# EAGLE design piezo-preamp-tickler_V3-7_single-supply-TL072 (EAGLE 8.7.0)

## Sheet 1 of 2
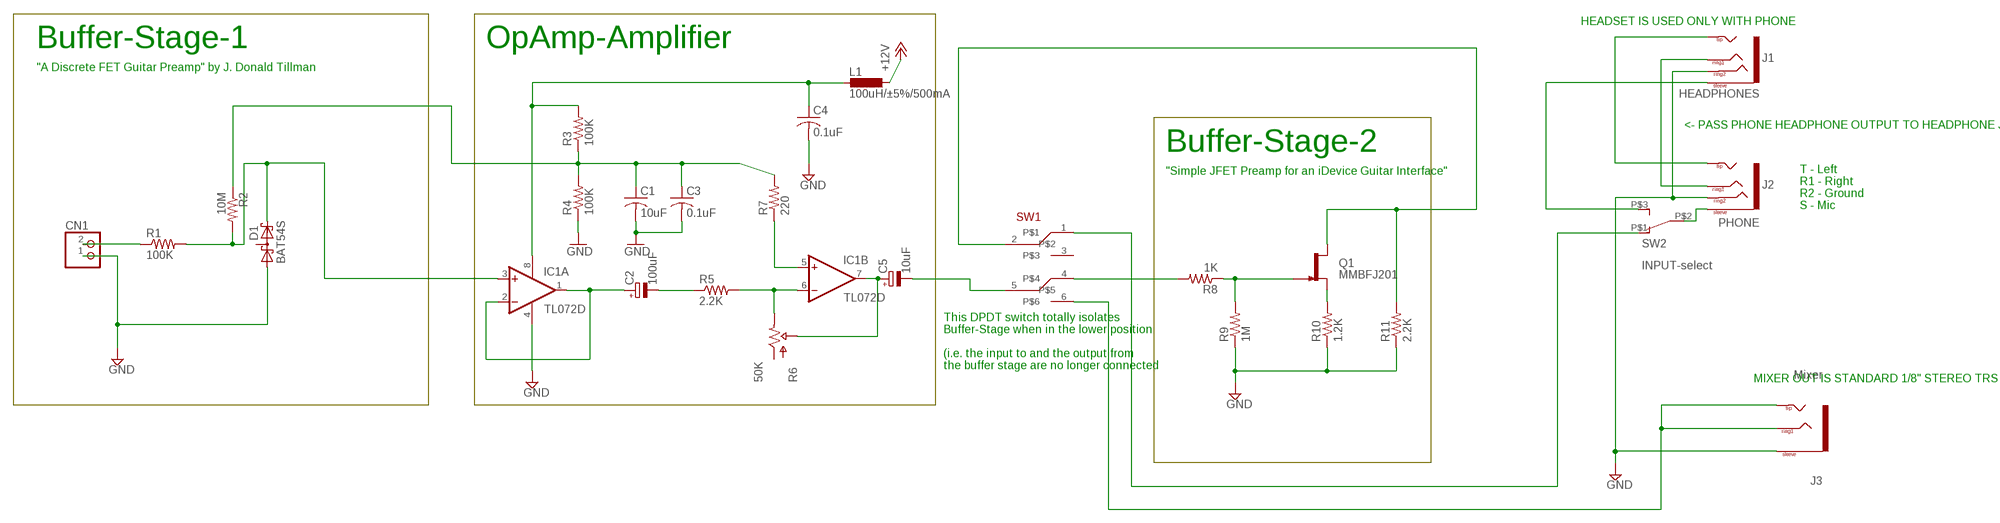
[diagram p0: schematic, sheet 1]

### Parts
C1  10uF  C-USC0805K  [C0805K]
C2  100uF  CPOL-EUC  [PANASONIC_C]
C3  0.1uF  C-USC0805K  [C0805K]
C4  0.1uF  C-USC0805K  [C0805K]
C5  10uF  CPOL-EUB  [PANASONIC_B]
CN1  JST_2PIN-THM  [JST-PH-2-THM]
D1  BAT54S  [SOT23]
IC1  TL072D  [SO08]
J1  HEADPHONES  TRRS-1/8"-3.5MMLGPADS  [TRRS_SJ-43514-SMT-TR]
J2  PHONE  TRRS-1/8"-3.5MMLGPADS  [TRRS_SJ-43514-SMT-TR]
J3  Mixer  TRS-1/8"-3.5MM  [TRS_SJ-3524-SMT]
L1  100uH/±5%/500mA  L-EUL3225M  [L3225M]
Q1  MMBFJ201  J201SOT-23  [SOT23-3]
R1  100K  R-US_R0603  [R0603]
R2  10M  R-US_R0603  [R0603]
R3  100K  R-US_R0603  [R0603]
R4  100K  R-US_R0603  [R0603]
R5  2.2K  R-US_R0603  [R0603]
R6  50K  POTTHUMBPOT14  [THUMBPOT14MM]
R7  220  R-US_R0603  [R0603]
R8  1K  R-US_R0603  [R0603]
R9  1M  R-US_R0603  [R0603]
R10  1.2K  R-US_R0603  [R0603]
R11  2.2K  R-US_R0603  [R0603]
SW1  SWITCH_DPDT  [SWITCH_DPDT_CL-SB-22B]
SW2  INPUT-select  SWITCH_SPDTCL-SB-12B  [SWITCH_SPDT_CL-SB-12B]

### Nets
+12V: L1.1 ; also sheet 2
GND: C1.2 C3.2 C4.2 CN1.1 D1.1(A1) IC1.4(P:V-) J1.RING2 J2.RING2 J3.1(SLEEVE) R4.1 R9.1 R10.1 R11.1 ; also sheet 2
N$1: D1.2(C2) IC1.3(A:+IN) R1.2 R2.2
N$2: CN1.2 R1.1
N$3: Q1.2(S) R10.2
N$4: J1.EARTH(SLEEVE) SW2.P$3
N$5: IC1.5(B:+IN) R7.1
N$6: C5.+ IC1.7(B:OUT) R6.P$2(WIPER)
N$7: IC1.6(B:-IN) R5.2 R6.P$3(OUT)
N$8: C4.1 IC1.8(P:V+) L1.2 R3.2
N$9: C1.1 C3.1 R2.1 R3.1 R4.2 R7.2
N$10: Q1.3(G) R8.1 R9.2
N$11: R8.2 SW1.4
N$12: J3.2(TIP) J3.3(RING1) J3.4(TIP) SW1.6
N$13: J1.RING1 J2.RING1
N$14: C2.- R5.1
N$16: C5.- SW1.5
N$17: J2.EARTH(SLEEVE) SW2.P$2
N$19: SW1.1 SW2.P$1
N$24: C2.+ IC1.1(A:OUT) IC1.2(A:-IN)
N$33: J1.TIP J2.TIP
SELECT: Q1.1(D) R11.2 SW1.2
Unconnected: D1.3(C1A2) R6.P$1(IN) SW1.3

### Notes on the sheet
- HEADSET IS USED ONLY WITH PHONE
- Buffer-Stage-1 | OpAmp-Amplifier
- "A Discrete FET Guitar Preamp" by J. Donald Tillman
- <- PASS PHONE HEADPHONE OUTPUT TO HEADPHONE JACK
- Buffer-Stage-2
- "Simple JFET Preamp for an iDevice Guitar Interface"
- T - Left
  R1 - Right
  R2 - Ground
  S - Mic
- This DPDT switch totally isolates 
  Buffer-Stage when in the lower position
  
  (i.e. the input to and the output from 
  the buffer stage are no longer connected
- MIXER OUT IS STANDARD 1/8" STEREO TRS

## Sheet 2 of 2
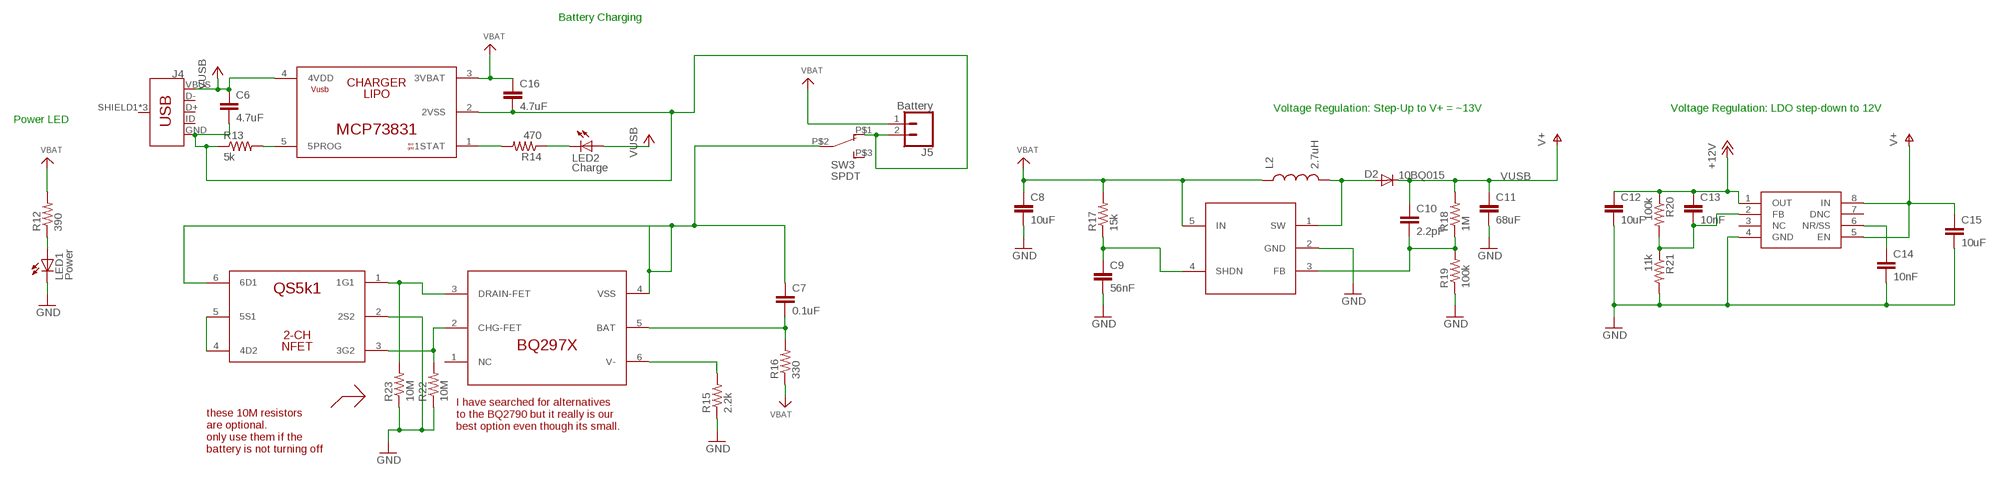
[diagram p1: schematic, sheet 2]

### Parts
C6  4.7uF  C-EUC0603  [C0603]
C7  0.1uF  C-EUC0603  [C0603]
C8  10uF  C-EUC0603  [C0603]
C9  56nF  C-EUC0603  [C0603]
C10  2.2pF  C-EUC0603  [C0603]
C11  68uF  C-EUC1206  [C1206]
C12  10uF  C-EUC0603  [C0603]
C13  10nF  C-EUC0603  [C0603]
C14  10nF  C-EUC0603  [C0603]
C15  10uF  C-EUC0603  [C0603]
C16  4.7uF  C-EUC0603  [C0603]
D2  10BQ015  DIODESMA  [SMA-DIODE]
IC2  MCP73831  [SOT-23-5]
IC3  QS6K1  [SOT457R_PHILIPS]
IC4  BQ297X  BQ297X-BATTERY-MANAGERLONG  [WSON-6-LONG]
IC5  SC4503  [SOT23-5]
IC6  TPS7A49  [MSOP-8]
J4  USB_MICRO-BREDUCED_PASTE  [USB-B-MICRO-SMD_RED_PASTE]
J5  Battery  CONN_02LOCK  [1X02_LOCK]
L2  2.7uH  INDUCTORCR54  [CR54]
LED1  Power  LED3MM  [LED3MM]
LED2  Charge  LED3MM  [LED3MM]
R12  390  R-US_R0603  [R0603]
R13  5k  R-US_R0603  [R0603]
R14  470  R-US_R0603  [R0603]
R15  2.2k  R-US_R0603  [R0603]
R16  330  R-US_R0603  [R0603]
R17  15k  R-US_R0603  [R0603]
R18  1M  R-US_R0603  [R0603]
R19  100k  R-US_R0603  [R0603]
R20  100k  R-US_R0603  [R0603]
R21  11k  R-US_R0603  [R0603]
R22  10M  R-US_R0603  [R0603]
R23  10M  R-US_R0603  [R0603]
SW3  SPDT  SWITCH_SPDTCL-SB-12B  [SWITCH_SPDT_CL-SB-12B]

### Nets
+5V: C6.1 IC2.4(4VDD) J4.VBUS LED2.A ; supply symbol labelled VUSB
+12V: C12.1 C13.1 IC6.1(OUT) R20.1 ; also sheet 1
BATGND: C7.1 IC3.6(6D1) IC4.4(VSS) SW3.P$2
GND: C8.2 C9.2 C11.2 C12.2 C14.2 C15.2 IC3.2(2S2) IC5.2(GND) IC6.4(GND) LED1.K(C) R15.1 R19.1 R21.2 R22.1 R23.1 ; also sheet 1
N$18: LED1.A R12.1
N$21: IC2.5(5PROG) R13.2
N$22: LED2.K(C) R14.1
N$23: IC3.4(4D2) IC3.5(5S1)
N$25: IC2.1(1STAT) R14.2
N$26: C13.2 IC6.2(FB) R20.2 R21.1
N$27: IC3.1(1G1) IC4.3(DRAIN-FET) R23.2
N$28: C14.1 IC6.6(NR/SS)
N$29: C9.1 IC5.4(SHDN) R17.1
N$30: C10.2 IC5.3(FB) R18.1 R19.2
N$31: IC3.3(3G2) IC4.2(CHG-FET) R22.2
N$32: D2.A IC5.1(SW) L2.P$2
N$34: IC4.6(V-) R15.2
N$42: C7.2 IC4.5(BAT) R16.2
USBGND: C6.2 C16.2 IC2.2(2VSS) J4.GND J5.2 R13.1 SW3.P$1
VBAT: C8.1 C16.1 IC2.3(3VBAT) IC5.5(IN) J5.1 L2.P$1 R12.2 R16.1 R17.2
VUSB: C10.1 C11.1 C15.1 D2.C IC6.5(EN) IC6.8(IN) R18.2 ; supply symbol labelled V+
Unconnected: IC4.1(NC) IC6.3(NC) IC6.7(DNC) J4.D+ J4.D- J4.ID J4.SHIELD1(SHIELD) J4.SHIELD2(SHIELD) J4.SHIELD3(SHIELD) SW3.P$3

### Notes on the sheet
- Battery Charging
- Voltage Regulation: Step-Up to V+ = ~13V | Voltage Regulation: LDO step-down to 12V
- Power LED
- I have searched for alternatives 
  to the BQ2790 but it really is our 
  best option even though its small.
- these 10M resistors
  are optional. 
  only use them if the 
  battery is not turning off

## Library data of the parts
C1 C3 C4 = adafruit:C-US: CAPACITOR, American symbol
C2 C5 = resistor:CPOL-EU: POLARIZED CAPACITOR, European symbol
C6-C16 = rcl:C-EU: CAPACITOR, European symbol; SPICEPREFIX: C
CN1 = adafruit:JST_2PIN: JST 2-Pin Connectors of various flavors SMT-RA (S2B-PH-SM4) 4UConnector #17311 SMT (B2B-PH-SM4) THM-RA (S2B-PH) THM (B2B-PH)
D1 = diode:BAT54S: Schottky Diodes Pin connection corrected 2011-05-04 Source: Fairchild .. BAT54.pdf
D2 = SparkFun:DIODE: Diode These are standard reverse protection diodes and small signal diodes. SMA package can handle up to about 1A. SOD-323 can handle about 200mA. What the SOD-323 package when ordering, there are some mfgs out there that are 5-pin packages.
IC1 = linear:TL072: OP AMP
IC2 = CMU-ArtFab:MCP73831
IC3 = CMU-ArtFab:QS6K1
IC4 = CMU-ArtFab:BQ297X-BATTERY-MANAGER
IC5 = CMU-ArtFab:SC4503
IC6 = CMU-ArtFab:TPS7A49
J1 J2 = CMU-ArtFab:TRRS-1/8"-3.5MM: Audio jack - 3.5mm TRRS variety - two rings.
J3 = CMU-ArtFab:TRS-1/8"-3.5MM
J4 = CMU-ArtFab:USB_MICRO-B: USB Type Micro-B Connector Male/female and PTH/SMT variants SparkFun Products: SparkFun microB USB Breakout <https://www.sparkfun.com/products/12035> SparkFun USB microB Plug Breakout <https://www.sparkfun.com/products/10031> SparkFun ESP8266 Thing <https://www.sparkfun.com/products/13231>; PROD_ID: CONN-11752
J5 = SparkFun-Connectors:CONN_02: Multi connection point. Often used as Generic Header-pin footprint for 0.1 inch spaced/style header connections On any of the 0.1 inch spaced packages, you can populate with these: Break Away Headers - Straight <https://www.sparkfun.com/products/116> (PRT-00116) Break Away Male Headers - Right Angle <https://www.sparkfun.com/products/553> (PRT-00553) Female Headers <https://www.sparkfun.com/products/115> (PRT-00115) Break Away Headers - Machine Pin <https://www.sparkfun.com/products/117> (PRT-00117) Break Away Female Headers - Swiss Machine Pin <https://www.sparkfun.com/products/743> (PRT-00743) For SCREWTERMINALS and SPRING TERMINALS visit here: Screw Terimnals on SparkFun.com <https://www.sparkfun.com/search/results?term=Screw+Terminals> (5mm/3.5mm/2.54mm spacing) This device is also useful as a general connection point to wire up your design to another part of your project. Our various solder wires solder well into these plated through hole pads. Hook-Up Wire - Assortment (Stranded, 22 AWG) <https://www.sparkfun.com/products/11375> (PRT-11375) Hook-Up Wire - Assortment (Solid Core, 22 AWG) <https://www.sparkfun.com/products/11367> (PRT-11367) View the entire wire category on our website here <https://www.sparkfun.com/categories/141> Special notes: Molex polarized connector foot print use with: PRT-08233 with associated crimp pins and housings. 2.54_SCREWTERM for use with PRT-10571. 3.5mm Screw Terminal footprints for PRT-08084 5mm Screw Terminal footprints for use with PRT-08432
L1 = rcl:L-EU: INDUCTOR, European symbol; SPICEPREFIX: L
L2 = SparkFun-Passives:INDUCTOR: Inductors Basic Inductor/Choke - 0603 and 1206. Footprints are not proven and vary greatly between part numbers. SRN6045- 33uH, 20% 1.4A SDR0403-560KL - 56uH, 10%, 500mA RMS/740mA peak
LED1 LED2 = led:LED: LED OSRAM: - CHIPLED LG R971, LG N971, LY N971, LG Q971, LY Q971, LO R971, LY R971 LH N974, LH R974 LS Q976, LO Q976, LY Q976 LO Q996 - Hyper CHIPLED LW Q18S LB Q993, LB Q99A, LB R99A - SideLED LS A670, LO A670, LY A670, LG A670, LP A670 LB A673, LV A673, LT A673, LW A673 LH A674 LY A675 LS A676, LA A676, LO A676, LY A676, LW A676 LS A679, LY A679, LG A679 - Hyper Micro SIDELED® LS Y876, LA Y876, LO Y876, LY Y876 LT Y87S - SmartLED LW L88C, LW L88S LB L89C, LB L89S, LG L890 LS L89K, LO L89K, LY L89K LS L896, LA L896, LO L896, LY L896 - TOPLED LS T670, LO T670, LY T670, LG T670, LP T670 LSG T670, LSP T670, LSY T670, LOP T670, LYG T670 LG T671, LOG T671, LSG T671 LB T673, LV T673, LT T673, LW T673 LH T674 LS T676, LA T676, LO T676, LY T676, LB T676, LH T676, LSB T676, LW T676 LB T67C, LV T67C, LT T67C, LS T67K, LO T67K, LY T67K, LW E67C LS E67B, LA E67B, LO E67B, LY E67B, LB E67C, LV E67C, LT E67C LW T67C LS T679, LY T679, LG T679 LS T770, LO T770, LY T770, LG T770, LP T770 LB T773, LV T773, LT T773, LW T773 LH T774 LS E675, LA E675, LY E675, LS T675 LS T776, LA T776, LO T776, LY T776, LB T776 LHGB T686 LT T68C, LB T68C - Hyper Mini TOPLED® LB M676 - Mini TOPLED Santana® LG M470 LS M47K, LO M47K, LY M47K Source: http://www.osram.convergy.de LUXEON: - LUMILED® LXK2-PW12-R00, LXK2-PW12-S00, LXK2-PW14-U00, LXK2-PW14-V00 LXK2-PM12-R00, LXK2-PM12-S00, LXK2-PM14-U00 LXK2-PE12-Q00, LXK2-PE12-R00, LXK2-PE12-S00, LXK2-PE14-T00, LXK2-PE14-U00 LXK2-PB12-K00, LXK2-PB12-L00, LXK2-PB12-M00, LXK2-PB14-N00, LXK2-PB14-P00, LXK2-PB14-Q00 LXK2-PR12-L00, LXK2-PR12-M00, LXK2-PR14-Q00, LXK2-PR14-R00 LXK2-PD12-Q00, LXK2-PD12-R00, LXK2-PD12-S00 LXK2-PH12-R00, LXK2-PH12-S00 LXK2-PL12-P00, LXK2-PL12-Q00, LXK2-PL12-R00 Source: www.luxeon.com KINGBRIGHT: KA-3528ASYC Source: www.kingbright.com
Q1 = CMU-ArtFab:J201: N-channel JFET
R1-R5 R7-R23 = CMU-ArtFab:R-US_: RESISTOR, American symbol
R6 = CMU-ArtFab:POT: http://www.taydaelectronics.com/10k-ohm-linear-taper-potentiometer-round-shaft-pcb-9mm.html http://www.taydaelectronics.com/datasheets/A-1847.pdf
SW1 = CMU-ArtFab:SWITCH_DPDT
SW2 SW3 = CMU-ArtFab:SWITCH_SPDT

## Board
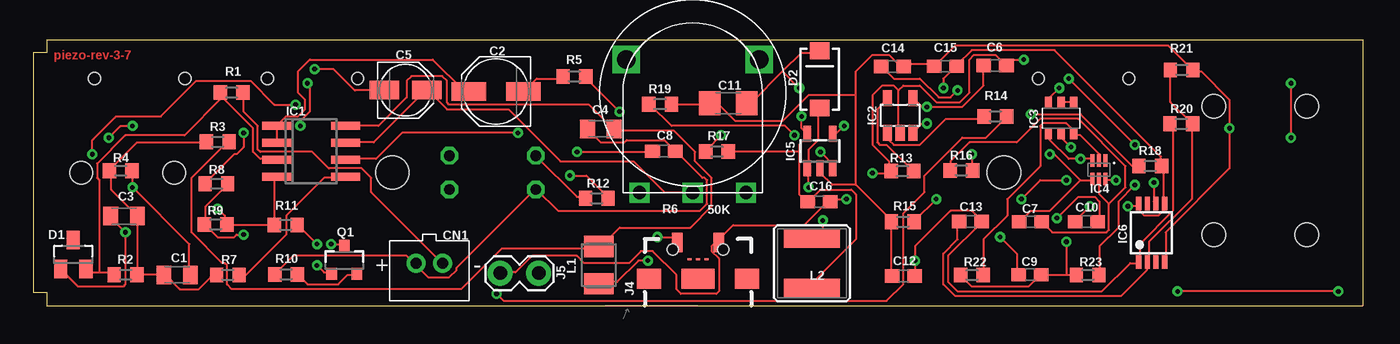
[diagram p2: board, top side]
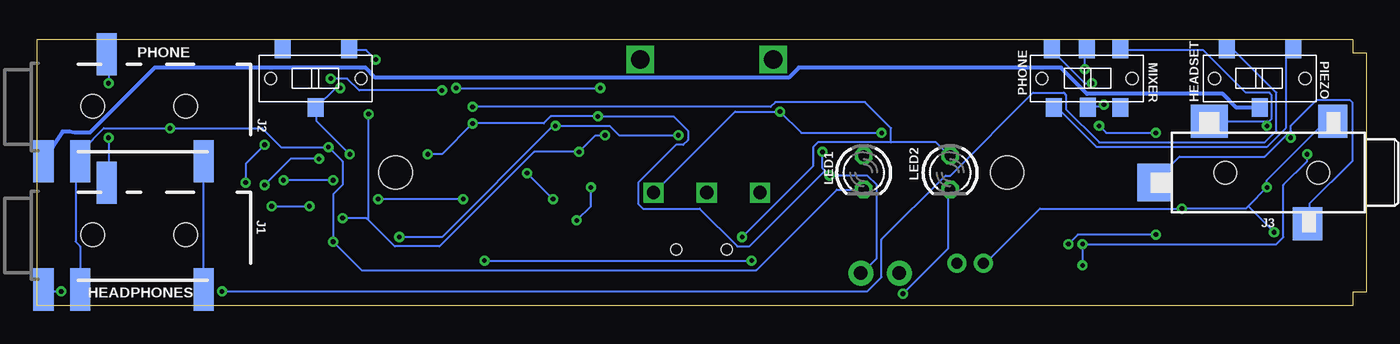
[diagram p3: board, bottom side, seen from below]

Size 100 x 20 mm. Coordinates in mm from the lower left corner, seen from the top.
Outline: 0,19 0,1 1.02,1 1,0 100,0 100,20 1,20 1,19 0,19
Copper layers (1*16): Top 0.035mm / dielectric 1.5mm / Bottom 0.035mm
Design rules "default *": minimum track width 6mil, minimum drill 0.35mm, track to track 8mil, track to pad 8mil, pad to pad 8mil, via to via 8mil, smd to smd 8mil, copper to edge 8mil, drill to drill 8mil, minimum pad ring 10mil, minimum via ring 8mil, stop-mask expansion 4mil, vias tented up to drill 20mil, thermal gap 10mil
Holes 2.5 mm at 73,10 27,10

### Footprints (pad centres in the part's own frame; a part is rotated, then mirrored left to right if it is on the bottom)
C0805K = smd 1.1 x 1.4: 1 -1,0; 2 1,0
PANASONIC_C = smd 2.6 x 1.4: + 2.05,0; - -2.05,0
PANASONIC_B = smd 2.2 x 1.4: + 1.6,0; - -1.6,0
C0603 = smd 1.1 x 1: 1 -0.85,0; 2 0.85,0
C1206 = smd 1.6 x 1.8: 1 -1.4,0; 2 1.4,0
JST-PH-2-THM = drill 0.8 pad 1.422: 1 1,0; 2 -1,0
SOT23 = smd 1 x 1.4: 1 -0.95,-1.1; 2 0.95,-1.1; 3 0,1.1
SMA-DIODE = smd 1.27 x 1.47: A -2.15,0; C 2.15,0
SO08 = smd 0.6 x 2.2: 1 -1.905,-2.6; 2 -0.635,-2.6; 3 0.635,-2.6; 4 1.905,-2.6; 5 1.905,2.6; 6 0.635,2.6; 7 -0.635,2.6; 8 -1.905,2.6
SOT-23-5 = smd 0.69 x 1.2: 1 -0.95,-1.3; 2 0,-1.3; 3 0.95,-1.3; 4 0.95,1.3; 5 -0.95,1.3
SOT457R_PHILIPS = smd 0.55 x 0.8: 1 -0.95,-1.2; 2 0,-1.2; 3 0.95,-1.2; 4 0.95,1.2; 5 0,1.2; 6 -0.95,1.2
WSON-6-LONG = smd 0.3 x 0.954: 1 -0.5,-0.686; 2 0,-0.686; 3 0.5,-0.686; 4 0.5,0.686; 5 0,0.686; 6 -0.5,0.686
SOT23-5 = smd 0.55 x 1.2: 1 -0.95,-1.3; 2 0,-1.3; 3 0.95,-1.3; 4 0.95,1.3; 5 -0.95,1.3
MSOP-8 = smd 0.4 x 1: 1 -0.975,-2.2; 2 -0.325,-2.2; 3 0.325,-2.2; 4 0.975,-2.2; 5 0.975,2.2; 6 0.325,2.2; 7 -0.325,2.2; 8 -0.975,2.2
TRRS_SJ-43514-SMT-TR = smd 1.524 x 3.175: EARTH -7.067,-4.128; RING1 -2.309,3.901; RING2 -4.293,-4.128; TIP 4.995,-4.128 | hole 1.778: -3.353,-0.007; 3.647,-0.007
TRS_SJ-3524-SMT = smd 2.5 x 2.2: 1 3.85,-4.6; 3 -3.85,-2.7 | smd 2.5 x 2.8: 2 3.85,4.7 | smd 2.8 x 2.5: 4 -0.75,8.85 | hole 1.7: 0,-3.5; 0,3.5
USB-B-MICRO-SMD_RED_PASTE = smd 0.152 x 0.305: D+ 1.455,0; D- 1.455,0.65; ID 1.455,-0.65 | smd 1.45 x 0.762: GND 2.725,-1.554 | smd 1.5 x 1.8: SHIELD1 0,3.685; SHIELD2 0,-3.685 | smd 1.5 x 2.5: SHIELD3 0,0 | smd 1.45 x 0.781: VBUS 2.725,1.554 | hole 0.85: 2.2,1.9; 2.2,-1.9
1X02_LOCK = drill 1.016 pad 1.88: 1 -0.178,0; 2 2.718,0
L3225M = smd 1.6 x 2.2: 1 -1.4,0; 2 1.4,0
CR54 = smd 4.2 x 1.4: P$1 0,1.85; P$2 0,-1.85
LED3MM = drill 0.813 octagon: A -1.27,0; K 1.27,0
SOT23-3 = smd 0.8 x 0.9: 1 -0.95,-1; 2 0.95,-1; 3 0,1.1
R0603 = smd 1 x 1.1: 1 -0.85,0; 2 0.85,0
THUMBPOT14MM = drill 1 square: P$1 -4,-7.5; P$2 0,-7.5; P$3 4,-7.5 | drill 1.4 square: P$4 -5,2.5; P$5 5,2.5
SWITCH_DPDT_CL-SB-22B = smd 1.2 x 1.4: 1 -2.5,-2.2; 2 0.05,-2.17; 3 2.5,-2.2; 4 -2.63,2.2; 5 0,2.2; 6 2.51,2.2 | hole 0.9: -3.4,0; 3.4,0
SWITCH_SPDT_CL-SB-12B = smd 1.2 x 1.4: P$1 -2.5,-2.2; P$2 0,2.2; P$3 2.5,-2.2 | hole 0.9: -3.4,0; 3.4,0

### Placement (x,y rotation side)
C1  10.82,2.31 0 top
C2  34.8,16.1 180 top
C3  6.83,6.73 180 top
C4  42.69,13.28 180 top
C5  28,16.2 0 top
C6  72.34,18.04 0 top
C7  75,6.3 0 top
C8  47.43,11.61 0 top
C9  74.96,2.32 0 top
C10  79.21,6.31 0 top
C11  52.27,15.2 180 top
C12  65.45,2.23 180 top
C13  70.49,6.32 180 top
C14  64.62,17.98 0 top
C15  68.6,18 180 top
C16  59.1,7.8 0 top
CN1  29.79,3.18 180 top
D1  3.01,3.84 0 top
D2  59.14,17 90 top
IC1  20.9,11.6 270 top
IC2  65.2,14.3 0 top
IC3  77.3,14.1 0 top
IC4  80.15,10.21 180 top
IC5  59.17,11.62 0 top
IC6  84.11,5.48 0 top
J1  92.43,5.33 0 bottom
J2  92.43,14.99 0 bottom
J3  7.11,10 90 bottom
J4  50,2.02 90 top
J5  37.84,2.44 180 top
L1  42.54,3.04 90 top
L2  58.57,3.19 180 top
LED1  37.8,10 270 bottom
LED2  31.3,10 270 bottom
Q1  23.39,3.4 0 top
R1  14.93,16.01 180 top
R2  6.94,2.32 180 top
R3  13.88,12.31 0 top
R4  6.58,10.14 180 top
R5  40.7,17.23 0 top
R6  49.6,16 0 top
R7  14.64,2.31 180 top
R8  13.78,9.16 180 top
R9  13.72,6.1 180 top
R10  19.02,2.34 0 top
R11  18.99,6.07 0 top
R12  42.38,8.07 0 top
R13  65.38,10.12 0 top
R14  72.36,14.22 180 top
R15  65.4,6.3 0 top
R16  69.81,10.16 180 top
R17  51.43,11.58 0 top
R18  84.01,10.49 0 top
R19  47.15,15.14 180 top
R20  86.34,13.67 0 top
R21  86.37,17.72 0 top
R22  70.6,2.3 0 top
R23  79.3,2.3 0 top
SW1  21,17.08 0 bottom
SW2  8,17.08 180 bottom
SW3  79,17.08 180 bottom

### Tracks (layer width: path | path; a pad name or v marks a point on that pad's centre or on a via)
+5V  (via drill 0.35)
  Top 0.152: C6.1 71.48,17.96 71.48,16.54 69.88,14.94 v67.21,14.94 66.85,14.94 66.32,15.47 IC2.4 | v46.94,5.16 48.18,5.16 48.54,4.8 J4.VBUS
  Bottom 0.152: v46.94,5.16 41.6,10.49 41.6,11.91 41.25,12.27 35.74,12.27 | 35.74,12.27 32.36,12.27 31.47,11.38 LED2.A | v67.21,14.94 44.81,14.94 44.45,15.29 37.69,15.29 35.74,13.34 35.74,12.27
+12V  (via drill 0.35)
  Top 0.152: R20.1 85.52,13.51 85.7,13.34 85.7,7.11 83.21,4.62 83.21,3.38 IC6.1 83.03,3.2 82.5,3.2 80.37,1.07 69.52,1.07 68.81,1.78 68.81,3.73 71.3,6.22 C13.1 71.3,6.4 70.59,7.11 68.99,7.11 66.32,4.45 v66.32,3.38 66.32,2.31 C12.1 | v46.23,3.38 45.52,3.38 43.92,1.78 42.67,1.78 L1.1
  Bottom 0.152: v66.32,3.38 v46.23,3.38
BATGND  (via drill 0.35)
  Top 0.152: v77.17,16.36 76.45,15.65 76.45,15.47 IC3.6 | 78.77,9.42 79.65,9.42 IC4.4 | 78.77,9.42 76.45,7.11 75.03,7.11 74.32,6.4 C7.1 | v76.45,11.38 76.81,11.38 78.77,9.42
  Bottom 0.152: v77.17,16.36 77.52,16.36 78.94,14.94 SW3.P$2 78.94,14.76 78.94,13.87 v76.45,11.38
GND  (via drill 0.35)
  Top 0.152: D1.1 2.13,2.67 3.38,1.42 6.76,1.42 6.93,1.6 v6.93,5.51 5.87,6.58 C3.2 | IC1.4 18.14,9.6 18.14,6.22 R11.1 18.14,6.04 14.58,6.04 R9.1 14.4,6.22 14.4,6.76 v13.87,7.29 | R4.1 7.47,10.13 v7.47,8.89 11.73,4.62 11.73,2.49 C1.2 | C4.2 41.78,13.16 42.67,12.27 44.45,12.27 44.63,12.45 47.47,12.45 48.18,11.73 C8.2 48.36,11.56 50.32,9.6 50.49,9.6 50.67,9.42 50.67,7.64 50.14,7.11 39.47,7.11 37.87,8.71 LED1.K 37.69,8.71 31.83,2.85 31.83,2.67 31.29,2.13 29.69,2.13 28.8,3.02 CN1.1 28.63,3.2 28.09,3.73 19.56,3.73 18.31,2.49 R10.1 | R22.1 69.88,2.13 70.59,1.42 74.85,1.42 75.74,2.31 C9.2 75.92,2.31 77.7,2.31 | 77.7,2.31 78.41,2.31 R23.1 | v78.05,11.91 77.34,12.62 77.34,12.8 IC3.2 | v77.7,4.8 77.7,2.31 | IC6.4 85.17,3.38 85.17,5.51 89.97,10.31 v89.97,13.34 89.97,15.47 87.83,17.6 87.3,17.6 R21.2 87.12,17.78 85.34,19.56 69.34,19.56 67.92,18.14 C15.2 67.74,18.14 65.61,18.14 C14.2 65.43,18.14 65.08,18.14 64.36,18.85 63.12,18.85 61.87,17.6 61.87,15.82 | R19.1 48.01,15.11 50.85,15.11 C11.2 51.03,15.11 51.56,15.11 52.81,13.87 56.36,13.87 58.32,15.82 61.87,15.82 | C12.2 64.54,2.31 64.54,6.22 R15.1 64.54,6.4 61.87,9.07 | 61.87,9.07 60.1,9.07 59.21,9.96 59.21,10.31 IC5.2 | 61.87,9.07 61.87,15.82
  Bottom 0.152: J3.1 2.67,13.69 3.2,13.69 7.47,9.42 v7.47,8.89 8.89,7.47 | 8.89,7.47 9.07,7.29 v13.87,7.29 24.54,7.29 28.63,3.2 CN1.1 | 8.89,7.47 v6.93,5.51 | J1.RING2 96.72,1.25 96.72,4.45 97.08,4.8 97.08,10.49 96.72,10.85 J2.RING2 96.55,11.02 96.55,11.73 94.94,13.34 v89.97,13.34 83.03,13.34 81.61,11.91 v78.05,11.91 76.99,10.85 76.99,9.07 77.7,8.36 v77.7,4.8 75.56,2.67 45.87,2.67 39.83,8.71 37.87,8.71 LED1.K
N$1
  Top 0.152: 4.98,2.49 4.27,2.49 4.09,2.67 D1.2 | 4.98,2.49 6.04,2.49 R2.2 | 14.22,15.65 14.22,16 R1.2 14.22,15.65 | 14.22,15.65 16.54,13.34 16.54,11.56 17.07,11.02 18.14,11.02 IC1.3 | 4.98,2.49 4.98,9.42 4.8,9.6 4.8,10.67 6.93,12.8 11.38,12.8 14.22,15.65
N$2
  Top 0.152: R1.1 15.82,16 15.82,14.58 16.89,13.51 16.89,11.73 17.07,11.56 20.98,11.56 22.23,10.31 24.71,10.31 25.43,9.6 25.43,8.53 30.76,3.2 CN1.2
N$3
  Top 0.152: Q1.2 24.18,2.31 23.65,2.31 22.94,1.6 20.62,1.6 19.91,2.31 R10.2
N$4  (via drill 0.35)
  Top 0.152: v98.15,1.07 v86.06,1.07
  Bottom 0.152: v86.06,1.07 37.52,1.07 36.45,2.13 36.45,4.98 31.65,9.78 31.29,9.78 25.07,16 22.76,16 22.58,15.82 22.58,14.76 20.09,12.27 7.64,12.27 6.76,13.16 6.76,16 9.96,19.2 10.49,19.2 SW2.P$3 | v98.15,1.07 99.39,1.07 J1.EARTH
N$5
  Top 0.152: R7.1 15.65,2.31 16,2.31 19.02,5.33 19.02,6.76 21.87,9.6 23.47,9.6 IC1.5
N$6
  Top 0.152: IC1.7 23.65,12.27 25.6,12.27 29.52,16.18 C5.+ 29.69,16.18 31.11,14.76 35.74,14.76 39.65,10.85 45.16,10.85 47.47,8.53 49.43,8.53 R6.P$2
N$7  (via drill 0.35)
  Top 0.152: v44.09,14.58 41.6,17.07 R5.2 | v36.45,12.98 27.74,12.98 25.78,11.02 23.65,11.02 IC1.6
  Bottom 0.152: R6.P$3 53.52,8.53 47.47,14.58 v44.09,14.58 42.49,12.98 v36.45,12.98
N$8
  Top 0.152: R3.2 14.58,12.27 11.91,9.6 11.91,5.51 14.22,3.2 14.4,3.2 14.58,3.02 14.58,1.6 14.94,1.25 32.18,1.25 35.2,4.27 42.49,4.27 L1.2 42.67,4.45 44.09,5.87 49.43,5.87 51.03,7.47 51.03,9.6 49.78,10.85 49.78,11.56 48.18,13.16 43.74,13.16 C4.1 43.56,13.34 41.78,15.11 31.29,15.11 31.11,15.29 31.11,16.89 30.76,17.25 28.45,17.25 28.09,16.89 28.09,15.65 25.96,13.51 23.65,13.51 IC1.8
N$9
  Top 0.152: R7.2 13.69,2.13 13.34,2.13 12.45,1.25 11.02,1.25 9.96,2.31 C1.1 9.78,2.31 7.82,2.31 R2.1 7.82,2.49 7.82,6.58 C3.1 7.82,6.76 5.87,8.71 5.87,10.13 R4.2 5.87,10.31 7.82,12.27 12.98,12.27 R3.1
N$10  (via drill 0.35)
  Top 0.152: v22.4,4.62 23.29,4.62 Q1.3 | v15.82,5.33 15.29,5.33 15.11,5.16 13.87,5.16 12.98,6.04 R9.2 12.98,6.22 12.98,7.47 14.58,9.07 R8.1
  Bottom 0.152: v22.4,4.62 21.69,5.33 v15.82,5.33
N$11  (via drill 0.35)
  Top 0.152: v15.82,12.98 15.82,11.91 15.29,11.38 15.11,11.38 12.98,9.25 R8.2 | v20.09,13.51 20.09,13.87 20.8,14.58 20.8,16.54 v20.62,16.71
  Bottom 0.152: v15.82,12.98 19.56,12.98 v20.09,13.51 | v20.62,16.71 21.16,16.71 23.65,19.2 SW1.4
N$12  (via drill 0.35)
  Top 0.152: v7.47,13.51 6.58,13.51 v5.69,12.62
  Bottom 0.152: 7.47,13.87 11.73,13.87 J3.2 | 7.47,13.87 7.29,13.87 7.11,14.05 7.11,15.82 7.29,16 9.07,16 12.27,19.2 18.31,19.2 SW1.6 | 5.69,13.16 5.69,13.51 3.73,15.47 1.25,15.47 1.07,15.29 1.07,10.85 4.27,7.64 4.27,6.22 J3.3 | 5.69,13.16 7.64,11.2 14.05,11.2 15.82,9.42 J3.4 | v7.47,13.51 7.47,13.87 | 5.69,13.16 v5.69,12.62
N$13  (via drill 0.35)
  Top 0.152: v94.59,16.71 v94.59,12.62
  Bottom 0.152: v94.59,12.62 94.59,9.25 J1.RING1 | v94.59,16.71 94.59,18.85 J2.RING1
N$14
  Top 0.152: R5.1 39.83,17.07 37.87,17.07 36.98,16.18 C2.-
N$16  (via drill 0.35)
  Top 0.152: v21.16,17.78 22.58,17.78 24.18,16.18 26.31,16.18 C5.-
  Bottom 0.152: v21.16,17.78 21.16,19.2 SW1.5
N$17
  Bottom 0.305: SW2.P$2 9.76,14.88 10.8,15.91 21,15.91 22.97,17.89 42.68,17.89 43.42,17.14 74.53,17.14 75.27,17.89 91.11,17.89 95.99,13.01 97.1,13.01 97.53,13.08 98.04,13.07 J2.EARTH
N$18
  Top 0.152: R12.1 41.43,8.18 40.89,8.18 37.87,11.2 LED1.A
N$19
  Bottom 0.152: SW1.1 23.47,14.76 23.11,14.76 20.27,11.91 7.47,11.91 6.04,13.34 6.04,18.67 5.51,19.2 SW2.P$1
N$21
  Top 0.152: R13.2 66.14,10.13 64.19,12.09 63.65,12.09 63.48,12.27 63.48,14.76 64.19,15.47 IC2.5
N$22  (via drill 0.35)
  Top 0.152: v34.85,0.89 35.38,0.36 64.19,0.36 65.43,1.6 65.43,6.93 67.03,8.53 67.03,9.78 69.88,12.62 71.65,12.62 73.08,14.05 R14.1
  Bottom 0.152: v34.85,0.89 31.47,4.27 31.47,8.71 LED2.K
N$23
  Top 0.152: IC3.5 77.34,15.29 78.23,15.29 IC3.4
N$24
  Top 0.152: IC1.2 18.31,12.27 18.31,13.34 IC1.1 18.31,13.51 19.02,14.22 19.91,14.22 20.45,14.76 20.45,15.47 19.91,16 19.91,17.6 20.8,18.49 30.05,18.49 32.36,16.18 32.72,16.18 C2.+
N$25
  Top 0.152: R14.2 71.48,14.05 68.63,14.05 66.67,12.09 64.72,12.09 64.36,12.45 64.36,12.98 IC2.1
N$26
  Top 0.152: C13.2 69.52,6.22 69.52,4.98 68.45,3.91 68.45,1.6 69.34,0.71 81.79,0.71 83.74,2.67 83.74,3.2 IC6.2 83.92,3.38 83.92,4.8 87.12,8 87.12,13.51 R20.2 87.12,13.69 85.52,15.29 85.52,17.6 R21.1
N$27  (via drill 0.35)
  Top 0.152: IC3.1 76.45,12.8 76.45,12.45 77.88,11.02 v78.77,11.02 79.65,11.02 IC4.3 | v82.86,9.07 81.61,7.82 81.61,5.87 80.19,4.45 80.19,2.31 R23.2
  Bottom 0.152: v82.86,9.07 80.9,11.02 v78.77,11.02
N$28  (via drill 0.35)
  Top 0.152: v84.28,9.25 84.28,7.82 IC6.6 | v77.88,17.07 v82.86,12.09 | v69.52,16.18 68.99,15.65 68.1,15.65 66.67,17.07 64.72,17.07 63.83,17.96 C14.1
  Bottom 0.152: v84.28,9.25 84.28,10.67 v82.86,12.09 | v77.88,17.07 76.63,17.07 75.74,16.18 v69.52,16.18
N$29  (via drill 0.35)
  Top 0.152: v51.74,12.8 50.67,11.73 R17.1 | v60.98,13.51 60.27,12.8 IC5.4 | v72.72,5.16 73.97,3.91 73.97,2.49 C9.1
  Bottom 0.152: v51.74,12.8 56.19,12.8 56.9,13.51 v60.98,13.51 61.16,13.51 69.52,5.16 v72.72,5.16
N$30  (via drill 0.35)
  Top 0.152: v57.25,12.8 56.54,13.51 48.01,13.51 46.41,15.11 R19.2 | v59.21,11.56 60.27,10.49 IC5.3 | v76.99,6.58 78.59,8.18 79.83,8.18 80.19,7.82 80.19,6.4 C10.2 | v75.03,14.4 78.77,14.4 82.68,10.49 83.03,10.49 R18.1
  Bottom 0.152: v57.25,12.8 57.96,12.8 v59.21,11.56 62.59,11.56 69.7,4.45 73.08,4.45 75.03,6.4 | v76.99,6.58 75.21,6.58 75.03,6.4 | 75.03,6.4 v75.03,14.4
N$31
  Top 0.152: IC4.2 80.19,11.02 80.19,11.38 78.77,12.8 78.41,12.8 IC3.3 78.41,12.98 77.7,13.69 75.92,13.69 75.74,13.51 75.74,10.49 73.25,8 73.25,6.76 71.48,4.98 71.48,2.31 R22.2
N$32  (via drill 0.35)
  Top 0.152: D2.A 59.03,14.76 59.03,12.45 58.32,11.73 58.32,10.49 IC5.1 58.32,10.31 v58.32,8.89 | v59.38,6.4 59.38,5.87 58.67,5.16 L2.P$2
  Bottom 0.152: v58.32,8.89 58.32,7.47 v59.38,6.4
N$33
  Bottom 0.152: J1.TIP 87.48,1.25 87.48,10.85 J2.TIP
N$34  (via drill 0.35)
  Top 0.152: v81.43,9.42 80.72,9.42 IC4.6 | v77.7,9.42 75.74,9.42 v74.32,8 | v67.92,8 66.32,6.4 R15.2
  Bottom 0.152: v77.7,9.42 v81.43,9.42 | v67.92,8 v74.32,8
N$42
  Top 0.152: 80.9,7.64 80.19,8.36 80.19,9.42 IC4.5 | 80.9,7.64 80.9,5.69 80.72,5.51 76.63,5.51 75.92,6.22 C7.2 | 80.9,7.64 82.14,8.89 82.14,10.49 78.59,14.05 75.74,14.05 73.97,12.27 70.41,12.27 68.99,10.85 68.99,10.31 R16.2
SELECT  (via drill 0.35)
  Top 0.152: v21.34,3.02 21.87,2.49 22.4,2.49 Q1.1 | v21.34,4.62 19.91,6.04 R11.2 | v19.74,15.11 18.14,15.11 16.36,16.89 12.27,16.89 9.6,14.22 6.22,14.22 4.45,12.45 v4.45,11.38
  Bottom 0.152: v21.34,3.02 v21.34,4.62 6.76,4.62 6.22,5.16 6.22,9.07 4.45,10.85 v4.45,11.38 | v19.74,15.11 19.91,14.94 20.8,14.94 SW1.2
USBGND  (via drill 0.35)
  Top 0.152: 65.08,16.18 64.72,16.54 63.83,16.54 63.12,15.82 63.12,12.09 64.36,10.85 64.36,10.13 R13.1 64.36,9.96 v63.12,9.96 | 65.08,16.18 65.08,13.16 IC2.2 | 65.08,16.18 65.43,16.54 66.67,16.54 67.92,15.29 69.7,15.29 70.41,16 70.41,18.49 70.76,18.85 72.36,18.85 73.08,18.14 C6.2 73.25,18.14 73.61,18.49 v74.5,18.49 | 51.38,4.8 52.63,6.04 57.96,6.04 59.56,7.64 59.92,7.64 C16.2 60.1,7.82 60.27,8 v61.16,8 | 51.38,4.8 51.03,4.45 51.03,4.09 51.56,3.56 51.56,1.07 51.38,0.89 48.72,0.89 48.36,1.25 48.36,2.31 46.58,4.09 45.7,4.09 44.81,3.2 41.43,3.2 40.89,3.73 37.52,3.73 36.27,2.49 35.2,2.49 J5.2 | 51.38,4.8 J4.GND
  Bottom 0.152: v74.5,18.49 75.21,19.2 76.45,19.2 SW3.P$1 | v61.16,8 v63.12,9.96
VBAT  (via drill 0.35)
  Top 0.152: v40.36,9.78 41.6,9.78 43.2,8.18 R12.2 | v40.89,11.56 46.41,11.56 C8.1 | v70.59,11.38 70.59,10.31 R16.1 | v67.21,13.69 66.85,13.69 66.32,13.16 IC2.3 | 57.61,11.56 57.61,12.09 58.32,12.8 IC5.5 58.14,12.98 57.78,13.34 v57.78,14.22 | 57.61,11.56 57.61,8.36 58.14,7.82 C16.1 58.32,7.82 59.21,8.71 61.52,8.71 61.87,8.36 61.87,4.98 58.67,1.78 58.67,1.42 L2.P$1 | 57.61,11.56 52.45,11.56 R17.2
  Bottom 0.152: J5.1 37.87,2.49 36.8,3.56 36.8,9.07 37.52,9.78 v40.36,9.78 40.72,10.13 | v40.89,11.56 40.89,10.31 40.72,10.13 | v70.59,11.38 69.52,11.38 v67.21,13.69 61.87,13.69 61.34,14.22 v57.78,14.22 52.09,14.22 51.03,13.16 51.03,12.45 51.38,12.09 51.92,12.09 54.76,9.25 54.76,7.64 54.41,7.29 50.14,7.29 47.3,4.45 46.41,4.45 40.72,10.13
VUSB  (via drill 0.35)
  Top 0.152: 56.36,17.6 54.05,15.29 53.7,15.29 C11.1 | 56.36,17.6 57.78,19.02 59.03,19.02 D2.C | 83.21,7.47 83.21,7.11 83.57,6.76 84.63,6.76 84.99,7.11 84.99,7.64 IC6.5 84.99,7.82 84.99,10.31 R18.2 84.81,10.49 84.81,11.2 76.81,19.2 70.59,19.2 69.52,18.14 C15.1 69.34,17.96 68.45,17.07 v68.45,16.36 | 83.21,7.47 83.21,7.64 IC6.8 83.21,7.47 | v79.48,7.47 78.41,6.4 C10.1 | 83.21,7.47 v82.32,7.47 | v57.61,16.36 56.36,17.6
  Bottom 0.152: v82.32,7.47 v79.48,7.47 | v68.45,16.36 v57.61,16.36

### Text on the board
Top: piezo-rev-3-7
bPlace: PIEZO | MIXER | PHONE | HEADSET